# Altium schematic sheet PiTopUSBHub_UB.SchDoc: Console/Blaster USB Hub
size A4; Author: Sorgelig; Revision: 2.0; SheetNumber: 2; SheetTotal: 2
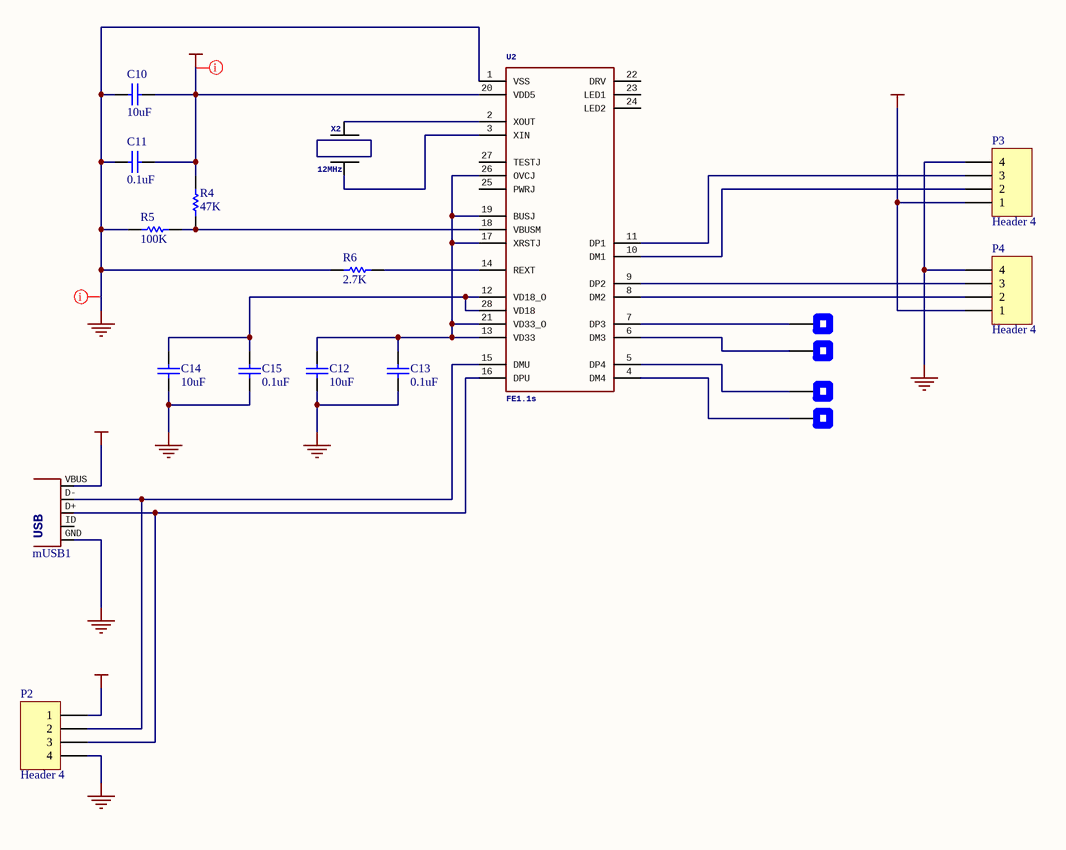
[diagram p0: PiTopUSBHub_UB.SchDoc]

## Parts
C10  value 10uF  [C0805]  (hidden comment: C0805)
C11  value 0.1uF  [C0805]  (hidden comment: C0805)
C12  value 10uF  [C0805]  (hidden comment: C0805)
C13  value 0.1uF  [C0805]  (hidden comment: C0805)
C14  value 10uF  [C0805]  (hidden comment: C0805)
C15  value 0.1uF  [C0805]  (hidden comment: C0805)
mUSB1  miniUSB-PTH  [miniUSB-F-PTH]  (value not drawn)
P2  Header 4  [HDR1X4]
P3  Header 4  [HDR1X4]
P4  Header 4  [HDR1X4]
R4  47K  [R0805]
R5  100K  [R0805]
R6  2.7K  [R0805]
TP1  TP  [TP]  (value not drawn)
TP2  TP  [TP]  (value not drawn)
TP3  TP  [TP]  (value not drawn)
TP4  TP  [TP]  (value not drawn)
U2  FE1.1S  [FE1.1S_SSOP-28]
X2  12MHz  [XTAL_G5032]

## Nets
GND: C10.2 C11.2 C12.2 C13.2 C14.2 C15.2 mUSB1.GND P2.4 P3.4 P4.4 R5.2 R6.1 U2.1(VSS)
VCC2: C10.1 C11.1 mUSB1.VBUS P2.1 P3.1 P4.1 R4.1 U2.20(VDD5)
NetC12_1: C12.1 C13.1 U2.13(VD33) U2.17(XRSTJ) U2.19(BUSJ) U2.21(VD33_O) U2.26(OVCJ)
NetC14_1: C14.1 C15.1 U2.12(VD18_O) U2.28(VD18)
NetmUSB1_D+: mUSB1.D+ P2.3 U2.16(DPU)
NetmUSB1_D-: mUSB1.D- P2.2 U2.15(DMU)
NetP3_2: P3.2 U2.10(DM1)
NetP3_3: P3.3 U2.11(DP1)
NetP4_2: P4.2 U2.8(DM2)
NetP4_3: P4.3 U2.9(DP2)
NetR4_2: R4.2 R5.1 U2.18(VBUSM)
NetR6_2: R6.2 U2.14(REXT)
NetTP1_1: TP1.1 U2.7(DP3)
NetTP2_1: TP2.1 U2.6(DM3)
NetTP3_1: TP3.1 U2.5(DP4)
NetTP4_1: TP4.1 U2.4(DM4)
NetU2_2: U2.2(XOUT) X2.2
NetU2_3: U2.3(XIN) X2.1

Not connected (* = marked no-connect by the designer): mUSB1 ID; U2 22(DRV) 23(LED1) 24(LED2) 25(PWRJ) 27(TESTJ)

## Layout directives
net class power: GND, VCC2

## Notes on the sheet
- Title
- Size:
- Date:
- A4
- Number:
- Time:
- Revision:
- Sheet
- of
- File:

## Library data of the parts
C10-C15 = C0805: Ceramic Chip Capacitor - Standard; Note: Footprint corresponds to dimensions for bulk cassette packaging. This case size has tightened tolerances.; Published: 17-Jul-2002; LatestRevisionDate: 19-Mar-2004; LatestRevisionNote: Silkscreen size reduced.; DatasheetDocument: Mar-2001; PackageDocument: Mar-2001; PackageReference: 0805; Publisher: Altium Limited; Code_JEITA: 0805; Code_IPC: 2012[0805]; ComponentLink1Description: Manufacturer Link; ComponentLink1URL: http://www.kemet.com/; ComponentLink2Description: Datasheet; ComponentLink2URL: http://www.kemet.com/kemet/web/homepage/kechome.nsf/vapubfilesname/F3102TA.pdf/$file/F3102TA.pdf
mUSB1 = miniUSBA-PTH: USB: USB
P2-P4 = Header 4: Header, 4-Pin; LatestRevisionDate: 17-Jul-2002; LatestRevisionNote: Re-released for DXP Platform.; Publisher: Altium Limited
R4-R6 = ERJ6RS: Low Ohmic Value Thick Film Chip Resistor, 0.1 Ohm to 0.2 Ohm Range, 1%, 2% and 5% Tolerance, 0805 Size, 0.125 W; Published: 17-Dec-2003; LatestRevisionDate: 19-Mar-2004; LatestRevisionNote: Silkscreen size reduced.; PackageDocument: Mar-2003; PackageReference: 6-0805; Publisher: Altium Limited; Code_IPC: 2012 [0805]; ComponentLink1Description: Manufacturer Link; ComponentLink1URL: http://www.panasonic.com/industrial/components/resistive_products.htm; ComponentLink2Description: Datasheet; ComponentLink2URL: http://www.panasonic.com/industrial/components/pdf/AOA0000CE3.pdf
X2 = CRYSTALHC49UP: PTH: ...   SMD: ...   Cylinder: CMR200T-32.768KDZBT
U2 = FE1.1S: FE1.1s: FE1.1s